# Altium project DIY_DAP_PCB.PrjPCB
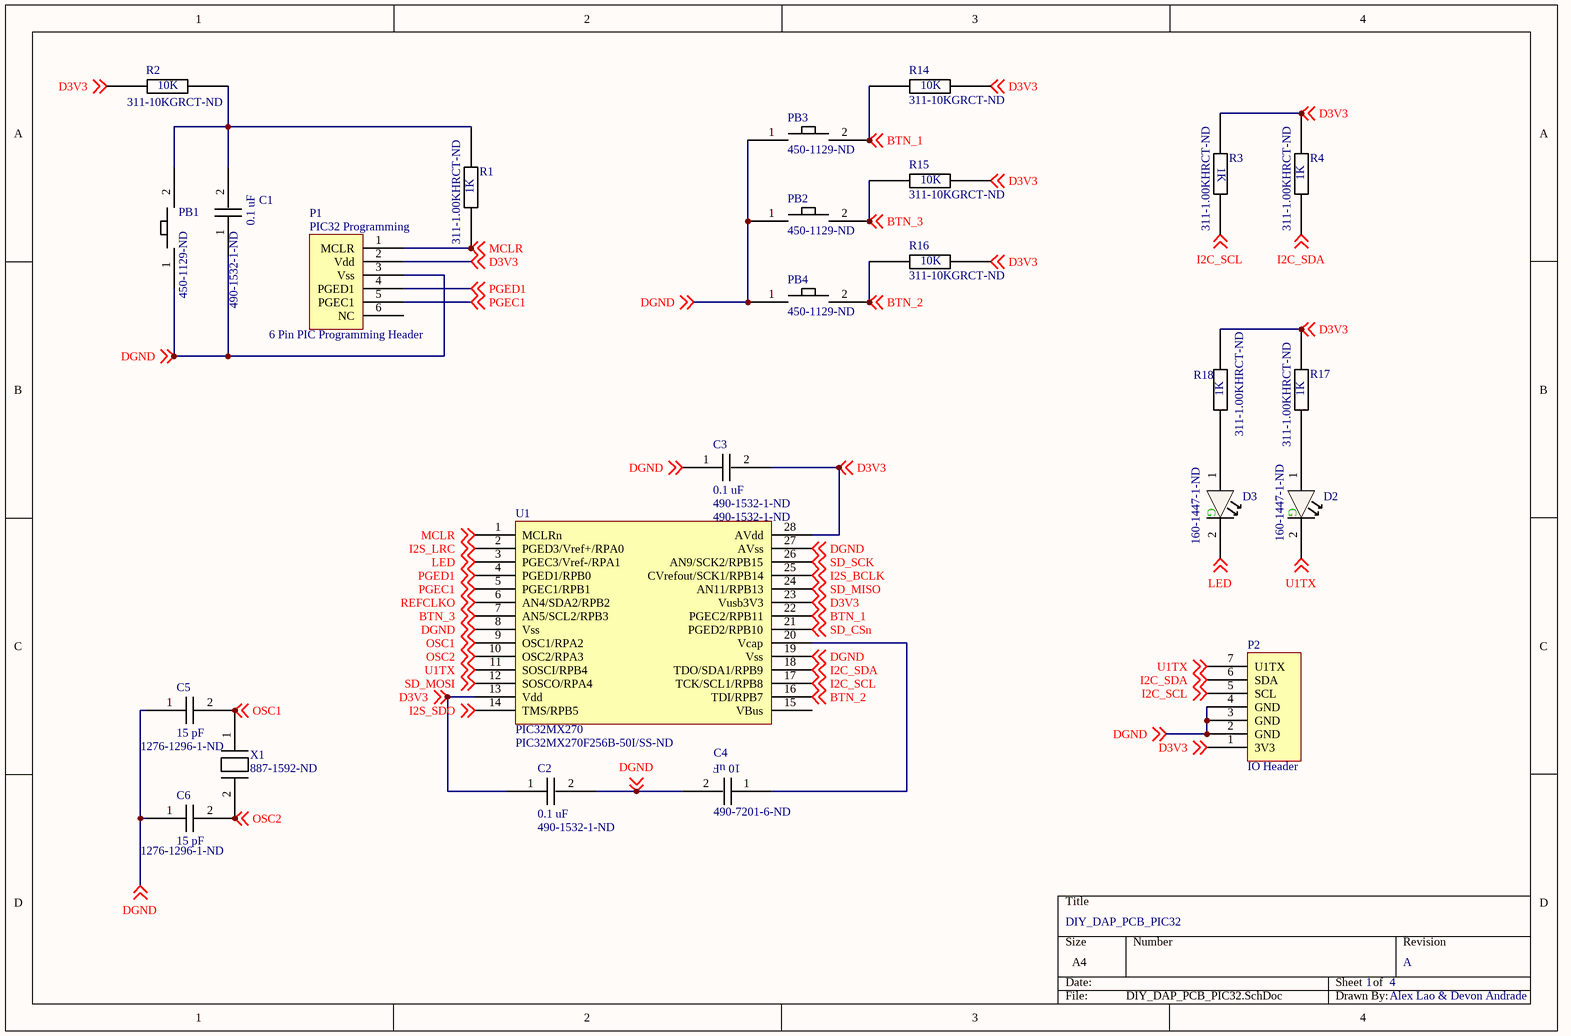
[diagram p0: DIY_DAP_PCB_PIC32.SchDoc]
4 sheets, 63 parts. Net scope: global (net labels, ports and power ports of the same name join across sheets).
Board file: DIY_DAP_PCB.PcbDoc
Sheets:
  DIY_DAP_PCB_PIC32.SchDoc
  DIY_DAP_PCB_Power.SchDoc
  DIY_DAP_PCB_Audio.SchDoc
  DIY_DAP_PCB_MicroSD.SchDoc

## Sheet DIY_DAP_PCB_PIC32.SchDoc: DIY_DAP_PCB_PIC32
size A4; Revision: A; SheetNumber: 1; SheetTotal: 4

### Parts
C1  490-1532-1-ND  [0603]
C2  490-1532-1-ND  [0603]
C3  490-1532-1-ND  [0603]
C4  490-7201-6-ND  [0603]
C5  1276-1296-1-ND  [0603]
C6  1276-1296-1-ND  [0603]
D2  160-1447-1-ND  [0603]
D3  160-1447-1-ND  [0603]
P1  6 Pin PIC Programming Header  [PIC32 Programming Header]
P2  IO Header  [IO Header]
PB1  450-1129-ND  [450-1129-ND]
PB2  450-1129-ND  [450-1129-ND]
PB3  450-1129-ND  [450-1129-ND]
PB4  450-1129-ND  [450-1129-ND]
R1  311-1.00KHRCT-ND  [0603]
R2  311-10KGRCT-ND  [0603]
R3  311-1.00KHRCT-ND  [0603]
R4  311-1.00KHRCT-ND  [0603]
R14  311-10KGRCT-ND  [0603]
R15  311-10KGRCT-ND  [0603]
R16  311-10KGRCT-ND  [0603]
R17  311-1.00KHRCT-ND  [0603]
R18  311-1.00KHRCT-ND  [0603]
U1  PIC32MX270  [PIC32MX270F256B-50I/SS-ND]
X1  887-1592-ND  [887-1592-ND]

### Nets
DGND: C1.1 C2.2 C3.1 C4.2 C5.1 C6.1 P1.3(Vss) P2.2(GND) P2.3(GND) P2.4(GND) PB1.1 PB2.1 PB3.1 PB4.1 U1.8(Vss) U1.19(Vss) U1.27(AVss) ; off-sheet DGND  [project net GND]
BTN_1: PB3.2 R14.1 U1.22(PGEC2/RPB11) ; off-sheet BTN_1
BTN_2: PB4.2 R16.1 U1.16(TDI/RPB7) ; off-sheet BTN_2
BTN_3: PB2.2 R15.1 U1.7(AN5/SCL2/RPB3) ; off-sheet BTN_3
D3V3: C2.1 C3.2 P1.2(Vdd) P2.1(3V3) R2.1 R3.1 R4.2 R14.2 R15.2 R16.2 R17.2 R18.2 U1.13(Vdd) U1.23(Vusb3V3) U1.28(AVdd) ; off-sheet D3V3  [project net 3V3]
I2C_SCL: P2.5(SCL) R3.2 U1.17(TCK/SCL1/RPB8) ; off-sheet I2C_SCL
I2C_SDA: P2.6(SDA) R4.1 U1.18(TDO/SDA1/RPB9) ; off-sheet I2C_SDA
I2S_BCLK: U1.25(CVrefout/SCK1/RPB14) ; off-sheet I2S_BCLK
I2S_LRC: U1.2(PGED3/Vref+/RPA0) ; off-sheet I2S_LRC
I2S_SDO: U1.14(TMS/RPB5) ; off-sheet I2S_SDO
LED: D3.2(-) U1.3(PGEC3/Vref-/RPA1) ; off-sheet LED
MCLR: P1.1(MCLR) R1.1 U1.1(MCLRn) ; off-sheet MCLR
OSC1: C5.2 U1.9(OSC1/RPA2) X1.1 ; off-sheet OSC1
OSC2: C6.2 U1.10(OSC2/RPA3) X1.2 ; off-sheet OSC2
PGEC1: P1.5(PGEC1) U1.5(PGEC1/RPB1) ; off-sheet PGEC1
PGED1: P1.4(PGED1) U1.4(PGED1/RPB0) ; off-sheet PGED1
REFCLKO: U1.6(AN4/SDA2/RPB2) ; off-sheet REFCLKO
SD_CSn: U1.21(PGED2/RPB10) ; off-sheet SD_CSn
SD_MISO: U1.24(AN11/RPB13) ; off-sheet SD_MISO
SD_MOSI: U1.12(SOSCO/RPA4) ; off-sheet SD_MOSI
SD_SCK: U1.26(AN9/SCK2/RPB15) ; off-sheet SD_SCK
U1TX: D2.2(-) P2.7(U1TX) U1.11(SOSCI/RPB4) ; off-sheet U1TX
NetC1_2: C1.2 PB1.2 R1.2 R2.2
NetC4_1: C4.1 U1.20(Vcap)
NetD2_1: D2.1(+) R17.1
NetD3_1: D3.1(+) R18.1

Not connected (* = marked no-connect by the designer): P1 6(NC); U1 15(VBus)

### Notes on the sheet
- Alex Lao & Devon Andrade
- (in symbol 6 Pin PIC Programming Header) PIC32 Programming
- (in symbol 160-1447-1-ND) G
- (in symbol 311-1.00KHRCT-ND) 1K
- (in symbol 311-10KGRCT-ND) 10K
- (in symbol 490-1532-1-ND) 0.1 uF
- (in symbol 490-7201-6-ND) 10 uF
- (in symbol 1276-1296-1-ND) 15 pF

### Library data of the parts
C1-C3 = 490-1532-1-ND: 0603 0.1 uF - 16V - Ceramic Capacitor; Supplier 1: Digi-Key
  C3: Supplier Part Number 1: 490-1532-1-ND
C4 = 490-7201-6-ND: 0603 10 uF - 16V - Ceramic Capacitor; Supplier 1: Digi-Key
C5 C6 = 1276-1296-1-ND: 0603 15 pF - 50V - Ceramic Capacitor; Supplier 1: Digi-Key
D2 D3 = 160-1447-1-ND: Green LED (0603); Supplier 1: Digi-Key
PB1-PB4 = 450-1129-ND: Momentary Push button; Supplier 1: Digi-Key
R1 R3 R4 R17 R18 = 311-1.00KHRCT-ND: 1k Ohm Resistor; Supplier 1: Digi-Key
R2 R14-R16 = 311-10KGRCT-ND: 10k Ohm Resistor; Supplier 1: Digi-Key
U1 = PIC32MX270F256B-50I/SS-ND: PIC32MX270F256B; Supplier 1: Digi-Key; Supplier Part Number 1: PIC32MX270F256B-50I/SS-ND
X1 = 887-1592-ND: 16.9344 Mhz Crystal; Supplier 1: Digi-Key

## Sheet DIY_DAP_PCB_Power.SchDoc: DIY_DAP_PCB_Power
size A4; Revision: A; SheetNumber: 4; SheetTotal: 4
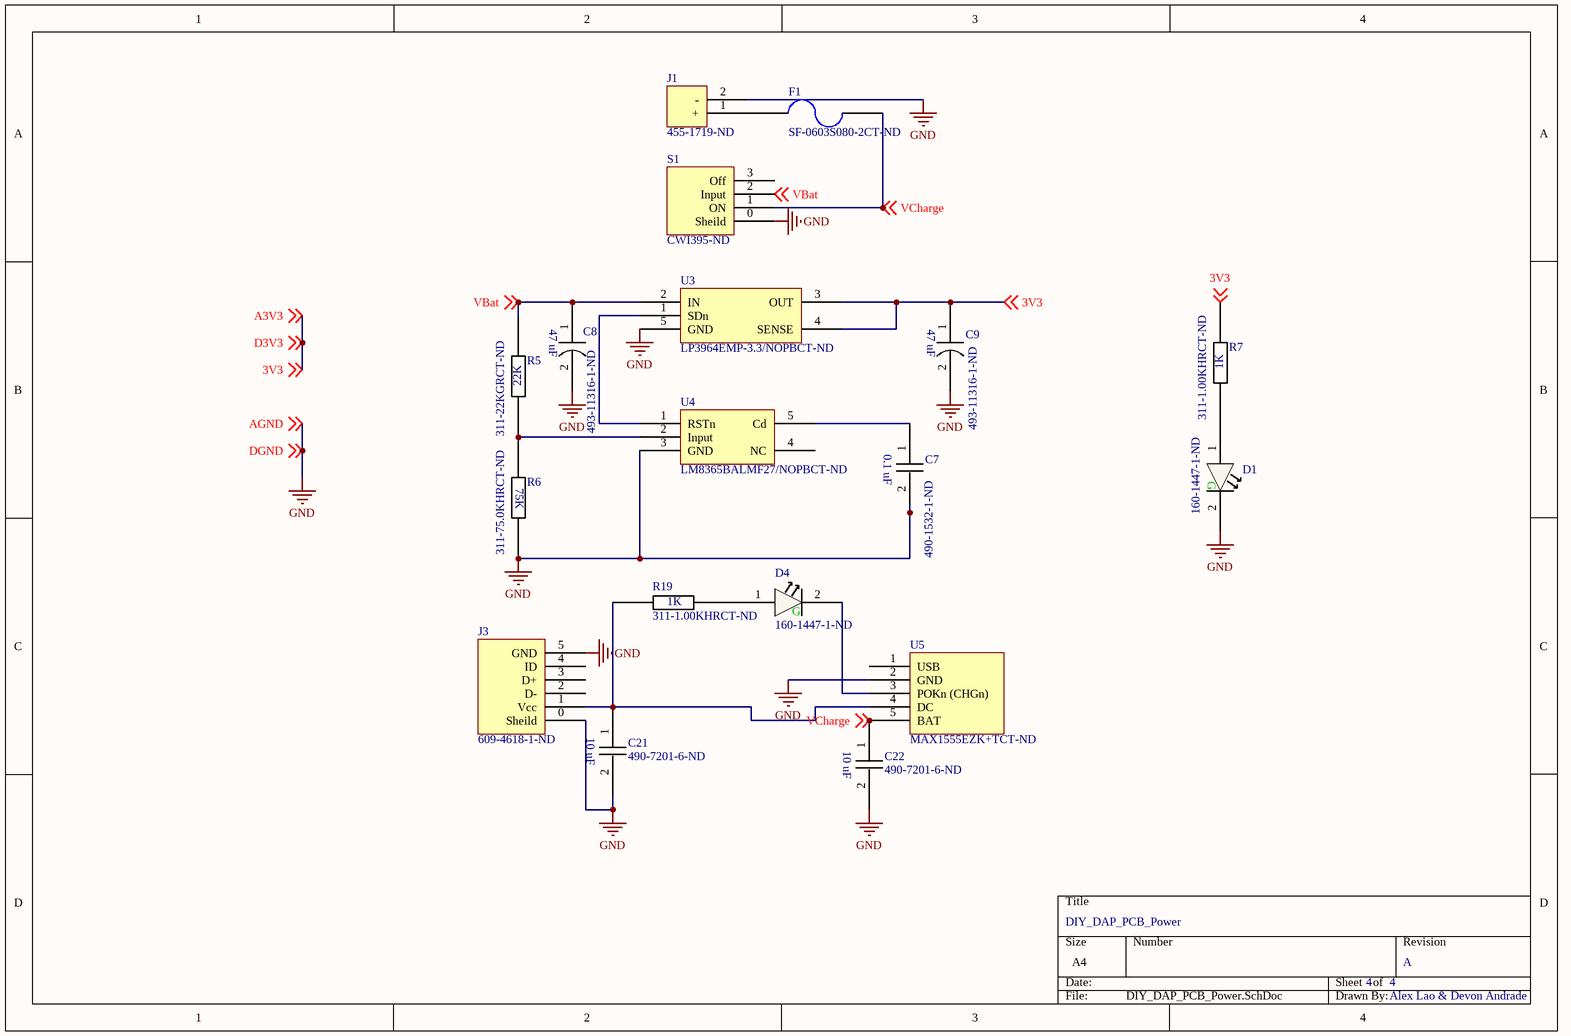
[diagram p1: DIY_DAP_PCB_Power.SchDoc]

### Parts
C7  490-1532-1-ND  [0603]
C8  493-11316-1-ND  [493-11316-1-ND]
C9  493-11316-1-ND  [493-11316-1-ND]
C21  490-7201-6-ND  [0603]
C22  490-7201-6-ND  [0603]
D1  160-1447-1-ND  [0603]
D4  160-1447-1-ND  [0603]
F1  SF-0603S080-2CT-ND  [0603]
J1  455-1719-ND  [455-1719-ND]
J3  609-4618-1-ND  [609-4618-1-ND]
R5  311-22KGRCT-ND  [0603]
R6  311-75.0KHRCT-ND  [0603]
R7  311-1.00KHRCT-ND  [0603]
R19  311-1.00KHRCT-ND  [0603]
S1  CWI395-ND  [CWI395-ND]
U3  LP3964EMP-3.3/NOPBCT-ND  [LP3964EMP-3.3/NOPBCT-ND]
U4  LM8365BALMF27/NOPBCT-ND  [LM8365BALMF27/NOPBCT-ND]
U5  MAX1555EZK+TCT-ND  [MAX1555EZK+TCT-ND]

### Nets
GND: C7.2 C8.2 C9.2 C21.2 C22.2 D1.2(-) J1.2(-) J3.0(Sheild) J3.5(GND) R6.2 S1.0(Sheild) U3.5(GND) U4.3(GND) U5.2(GND) ; off-sheet AGND, off-sheet DGND  [also labelled AGND, DGND]
3V3: C9.1 R7.2 U3.3(OUT) U3.4(SENSE) ; off-sheet 3V3, off-sheet A3V3, off-sheet D3V3  [also labelled A3V3, D3V3]
VBat: C8.1 R5.2 S1.2(Input) U3.2(IN) ; off-sheet VBat
VCharge: C22.1 F1.2 S1.1(ON) U5.5(BAT) ; off-sheet VCharge
NetC7_1: C7.1 U4.5(Cd)
NetC21_1: C21.1 J3.1(Vcc) R19.1 U5.4(DC)
NetD1_1: D1.1(+) R7.1
NetD4_1: D4.1(+) R19.2
NetD4_2: D4.2(-) U5.3(POKn_(CHGn))
NetF1_1: F1.1 J1.1(+)
NetR5_1: R5.1 R6.1 U4.2(Input)
NetU3_1: U3.1(SDn) U4.1(RSTn)

Not connected (* = marked no-connect by the designer): J3 2(D-) 3(D+) 4(ID); S1 3(Off); U4 4(NC); U5 1(USB)

### Notes on the sheet
- Alex Lao & Devon Andrade
- (in symbol 160-1447-1-ND) G
- (in symbol 311-1.00KHRCT-ND) 1K
- (in symbol 311-22KGRCT-ND) 22K
- (in symbol 311-75.0KHRCT-ND) 75K
- (in symbol 490-1532-1-ND) 0.1 uF
- (in symbol 490-7201-6-ND) 10 uF
- (in symbol 493-11316-1-ND) 47 uF

### Library data of the parts
C7 = 490-1532-1-ND: 0603 0.1 uF - 16V - Ceramic Capacitor; Supplier 1: Digi-Key
C8 C9 = 493-11316-1-ND: 47 uF - 10V - Electrolytic Capacitor; Supplier 1: Digi-Key
C21 C22 = 490-7201-6-ND: 0603 10 uF - 16V - Ceramic Capacitor; Supplier 1: Digi-Key
D1 D4 = 160-1447-1-ND: Green LED (0603); Supplier 1: Digi-Key
F1 = SF-0603S080-2CT-ND: 800 mA 32VDC Fuse; Supplier 1: Digi-Key
J1 = 455-1719-ND: JST-PH Battery Connector; Supplier 1: Digi-Key
J3 = 609-4618-1-ND: USB Micro-B; Supplier 1: Digi-Key
R5 = 311-22KGRCT-ND: 22k Ohm Resistor; Supplier 1: Digi-Key
R6 = 311-75.0KHRCT-ND: 75k Ohm Resistor; Supplier 1: Digi-Key
R7 R19 = 311-1.00KHRCT-ND: 1k Ohm Resistor; Supplier 1: Digi-Key
U3 = LP3964EMP-3.3/NOPBCT-ND: 3.3V LDO; Supplier 1: Digi-Key
U4 = LM8365BALMF27/NOPBCT-ND: Undervoltage Reset Controller; Supplier 1: Digi-Key
U5 = MAX1555EZK+TCT-ND: LiPo Charger; Supplier 1: Digi-Key
S1 = CWI395-ND: Supplier 1: Digi-Key

## Sheet DIY_DAP_PCB_Audio.SchDoc: DIY_DAP_PCB_Audio
size A4; Revision: A; SheetNumber: 2; SheetTotal: 4
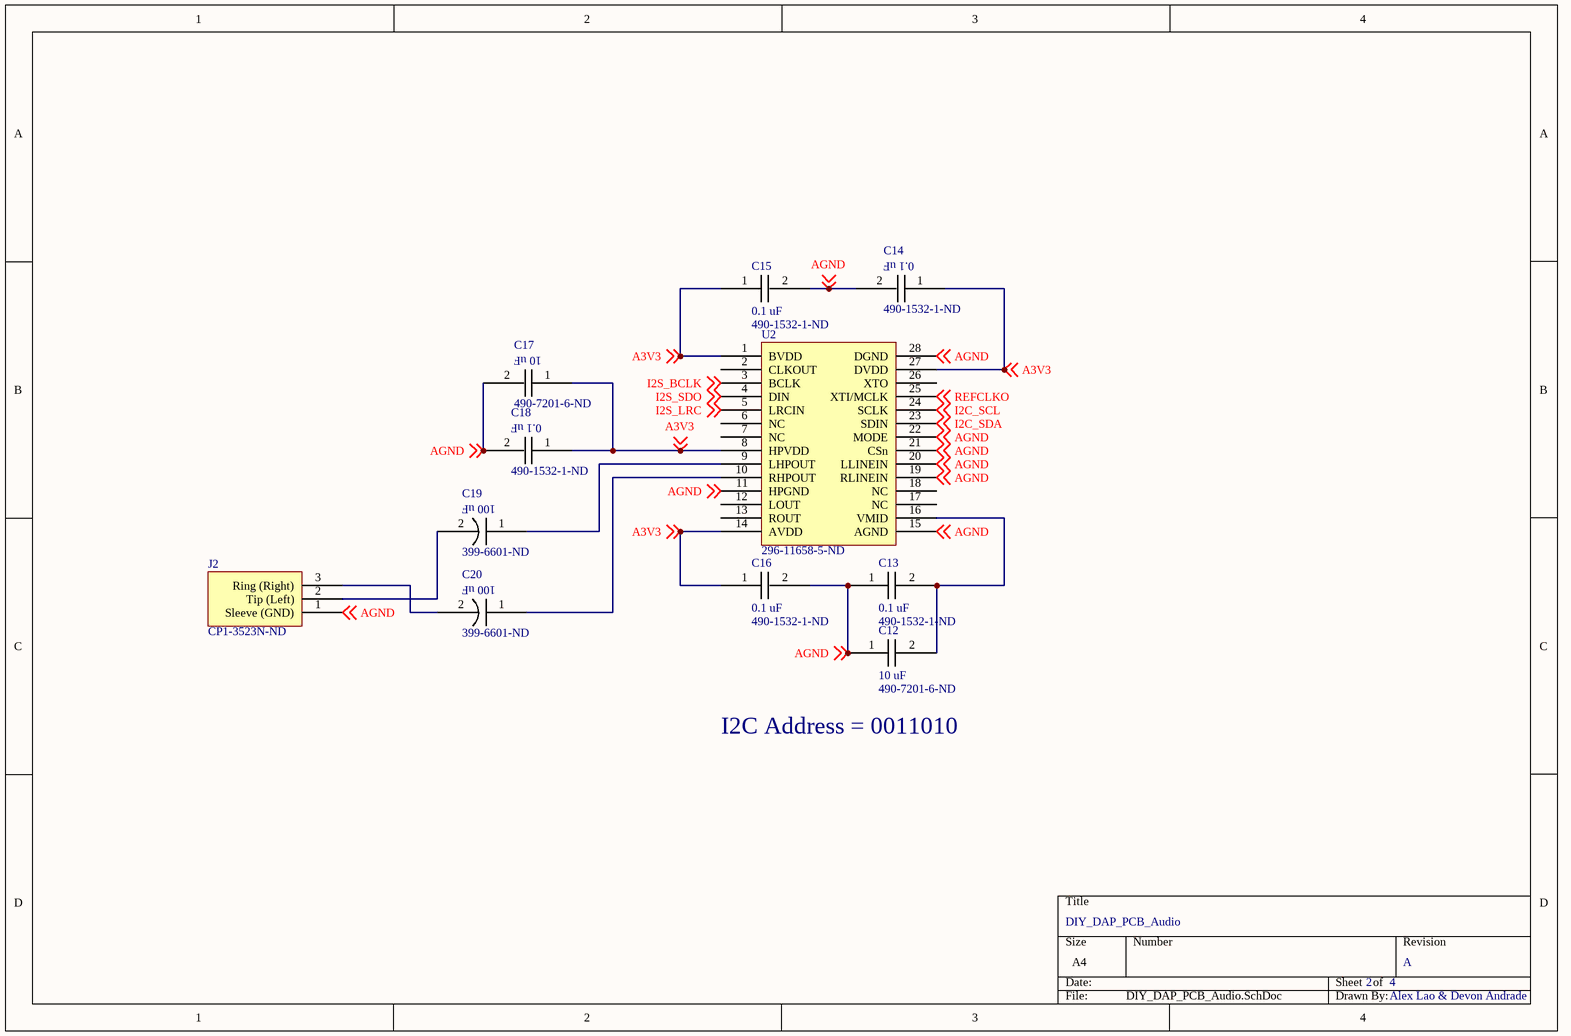
[diagram p2: DIY_DAP_PCB_Audio.SchDoc]

### Parts
C12  490-7201-6-ND  [0603]
C13  490-1532-1-ND  [0603]
C14  490-1532-1-ND  [0603]
C15  490-1532-1-ND  [0603]
C16  490-1532-1-ND  [0603]
C17  490-7201-6-ND  [0603]
C18  490-1532-1-ND  [0603]
C19  399-6601-ND  [399-6601-ND]
C20  399-6601-ND  [399-6601-ND]
J2  CP1-3523N-ND  [CP1-3523N-ND]
U2  296-11658-5-ND  [296-11658-5-ND]

### Nets
AGND: C12.1 C13.1 C14.2 C15.2 C16.2 C17.2 C18.2 J2.1(Sleeve_(GND)) U2.11(HPGND) U2.15(AGND) U2.19(RLINEIN) U2.20(LLINEIN) U2.21(CSn) U2.22(MODE) U2.28(DGND) ; off-sheet AGND  [project net GND]
A3V3: C14.1 C15.1 C16.1 C17.1 C18.1 U2.1(BVDD) U2.8(HPVDD) U2.14(AVDD) U2.27(DVDD) ; off-sheet A3V3  [project net 3V3]
I2C_SCL: U2.24(SCLK) ; off-sheet I2C_SCL
I2C_SDA: U2.23(SDIN) ; off-sheet I2C_SDA
I2S_BCLK: U2.3(BCLK) ; off-sheet I2S_BCLK
I2S_LRC: U2.5(LRCIN) ; off-sheet I2S_LRC
I2S_SDO: U2.4(DIN) ; off-sheet I2S_SDO
REFCLKO: U2.25(XTI/MCLK) ; off-sheet REFCLKO
NetC12_2: C12.2 C13.2 U2.16(VMID)
NetC19_1: C19.1 U2.9(LHPOUT)
NetC19_2: C19.2 J2.2(Tip_(Left))
NetC20_1: C20.1 U2.10(RHPOUT)
NetC20_2: C20.2 J2.3(Ring_(Right))

Not connected (* = marked no-connect by the designer): U2 2(CLKOUT) 6(NC) 7(NC) 12(LOUT) 13(ROUT) 17(NC) 18(NC) 26(XTO)

### Notes on the sheet
- I2C Address = 0011010
- Alex Lao & Devon Andrade
- (in symbol 399-6601-ND) 100 uF
- (in symbol 490-1532-1-ND) 0.1 uF
- (in symbol 490-7201-6-ND) 10 uF

### Library data of the parts
C12 C17 = 490-7201-6-ND: 0603 10 uF - 16V - Ceramic Capacitor; Supplier 1: Digi-Key
C13-C16 C18 = 490-1532-1-ND: 0603 0.1 uF - 16V - Ceramic Capacitor; Supplier 1: Digi-Key
C19 C20 = 399-6601-ND: 100 uF - 16V - Electrolytic Capacitor; Supplier 1: Digi-Key
J2 = CP1-3523N-ND: 3.5mm Audio Jack; Supplier 1: Digi-Key
U2 = 296-11658-5-ND: TLV320DAC23PW; Supplier 1: Digi-Key

## Sheet DIY_DAP_PCB_MicroSD.SchDoc: DIY_DAP_PCB_MicroSD
size A4; Revision: A; SheetNumber: 3; SheetTotal: 4
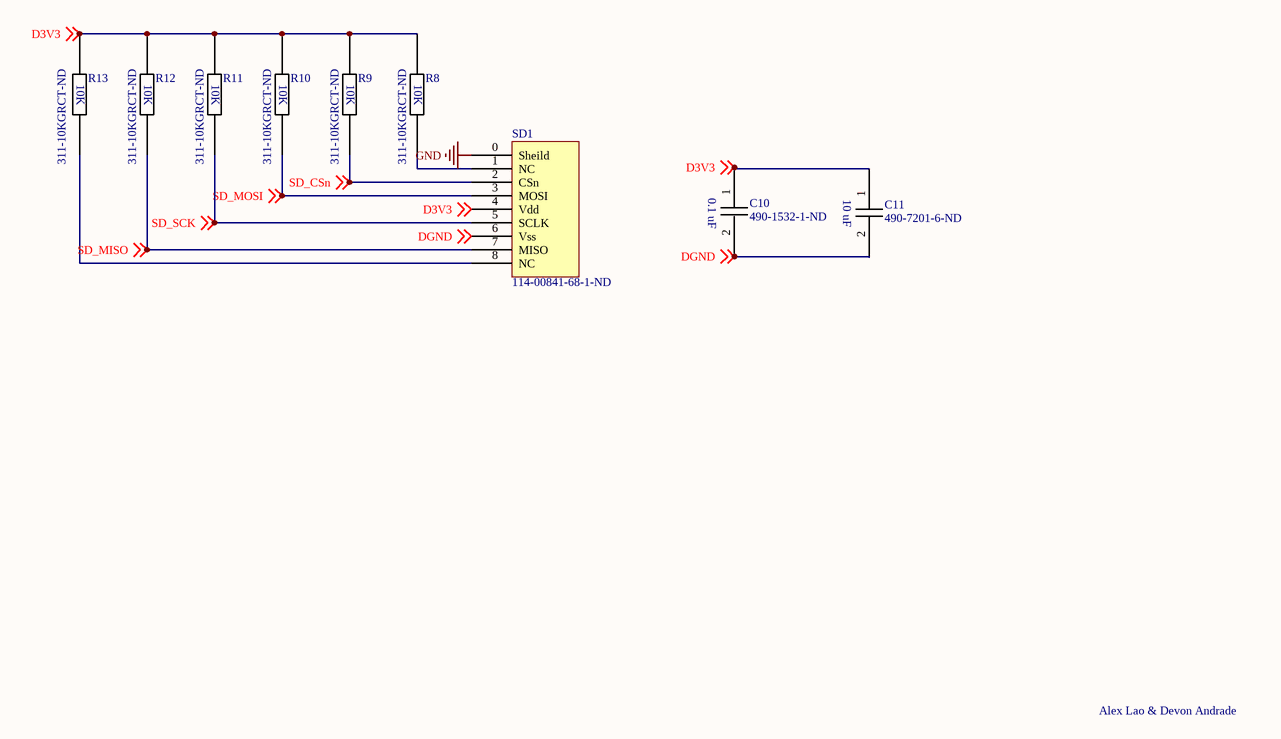
[diagram p3: DIY_DAP_PCB_MicroSD.SchDoc]

### Parts
C10  490-1532-1-ND  [0603]
C11  490-7201-6-ND  [0603]
R8  311-10KGRCT-ND  [0603]
R9  311-10KGRCT-ND  [0603]
R10  311-10KGRCT-ND  [0603]
R11  311-10KGRCT-ND  [0603]
R12  311-10KGRCT-ND  [0603]
R13  311-10KGRCT-ND  [0603]
SD1  114-00841-68-1-ND  [114-00841-68-1-ND]

### Nets
GND: C10.2 C11.2 SD1.0(Sheild) SD1.6(Vss) ; off-sheet DGND  [also labelled DGND]
D3V3: C10.1 C11.1 R8.1 R9.1 R10.1 R11.1 R12.1 R13.1 SD1.4(Vdd) ; off-sheet D3V3  [project net 3V3]
SD_CSn: R9.2 SD1.2(CSn) ; off-sheet SD_CSn
SD_MISO: R12.2 SD1.7(MISO) ; off-sheet SD_MISO
SD_MOSI: R10.2 SD1.3(MOSI) ; off-sheet SD_MOSI
SD_SCK: R11.2 SD1.5(SCLK) ; off-sheet SD_SCK
NetR8_2: R8.2 SD1.1(NC)
NetR13_2: R13.2 SD1.8(NC)

### Notes on the sheet
- Alex Lao & Devon Andrade
- (in symbol 311-10KGRCT-ND) 10K
- (in symbol 490-1532-1-ND) 0.1 uF
- (in symbol 490-7201-6-ND) 10 uF

### Library data of the parts
C10 = 490-1532-1-ND: 0603 0.1 uF - 16V - Ceramic Capacitor; Supplier 1: Digi-Key
C11 = 490-7201-6-ND: 0603 10 uF - 16V - Ceramic Capacitor; Supplier 1: Digi-Key
R8-R13 = 311-10KGRCT-ND: 10k Ohm Resistor; Supplier 1: Digi-Key
SD1 = 114-00841-68-1-ND: MicroSD Card Slot; Supplier 1: Digi-Key

## Nets that join several sheets
GND: DIY_DAP_PCB_PIC32 (17 pins), DIY_DAP_PCB_Power (14 pins), DIY_DAP_PCB_Audio (15 pins), DIY_DAP_PCB_MicroSD (C10.2 C11.2 SD1.0 SD1.6)
3V3: DIY_DAP_PCB_PIC32 (15 pins), DIY_DAP_PCB_Power (C9.1 R7.2 U3.3 U3.4), DIY_DAP_PCB_Audio (9 pins), DIY_DAP_PCB_MicroSD (9 pins)
I2C_SCL: DIY_DAP_PCB_PIC32 (P2.5 R3.2 U1.17), DIY_DAP_PCB_Audio (U2.24)
I2C_SDA: DIY_DAP_PCB_PIC32 (P2.6 R4.1 U1.18), DIY_DAP_PCB_Audio (U2.23)
I2S_BCLK: DIY_DAP_PCB_PIC32 (U1.25), DIY_DAP_PCB_Audio (U2.3)
I2S_LRC: DIY_DAP_PCB_PIC32 (U1.2), DIY_DAP_PCB_Audio (U2.5)
I2S_SDO: DIY_DAP_PCB_PIC32 (U1.14), DIY_DAP_PCB_Audio (U2.4)
REFCLKO: DIY_DAP_PCB_PIC32 (U1.6), DIY_DAP_PCB_Audio (U2.25)
SD_CSn: DIY_DAP_PCB_PIC32 (U1.21), DIY_DAP_PCB_MicroSD (R9.2 SD1.2)
SD_MISO: DIY_DAP_PCB_PIC32 (U1.24), DIY_DAP_PCB_MicroSD (R12.2 SD1.7)
SD_MOSI: DIY_DAP_PCB_PIC32 (U1.12), DIY_DAP_PCB_MicroSD (R10.2 SD1.3)
SD_SCK: DIY_DAP_PCB_PIC32 (U1.26), DIY_DAP_PCB_MicroSD (R11.2 SD1.5)